# EAGLE design mega324 Control Board (EAGLE 5.07)
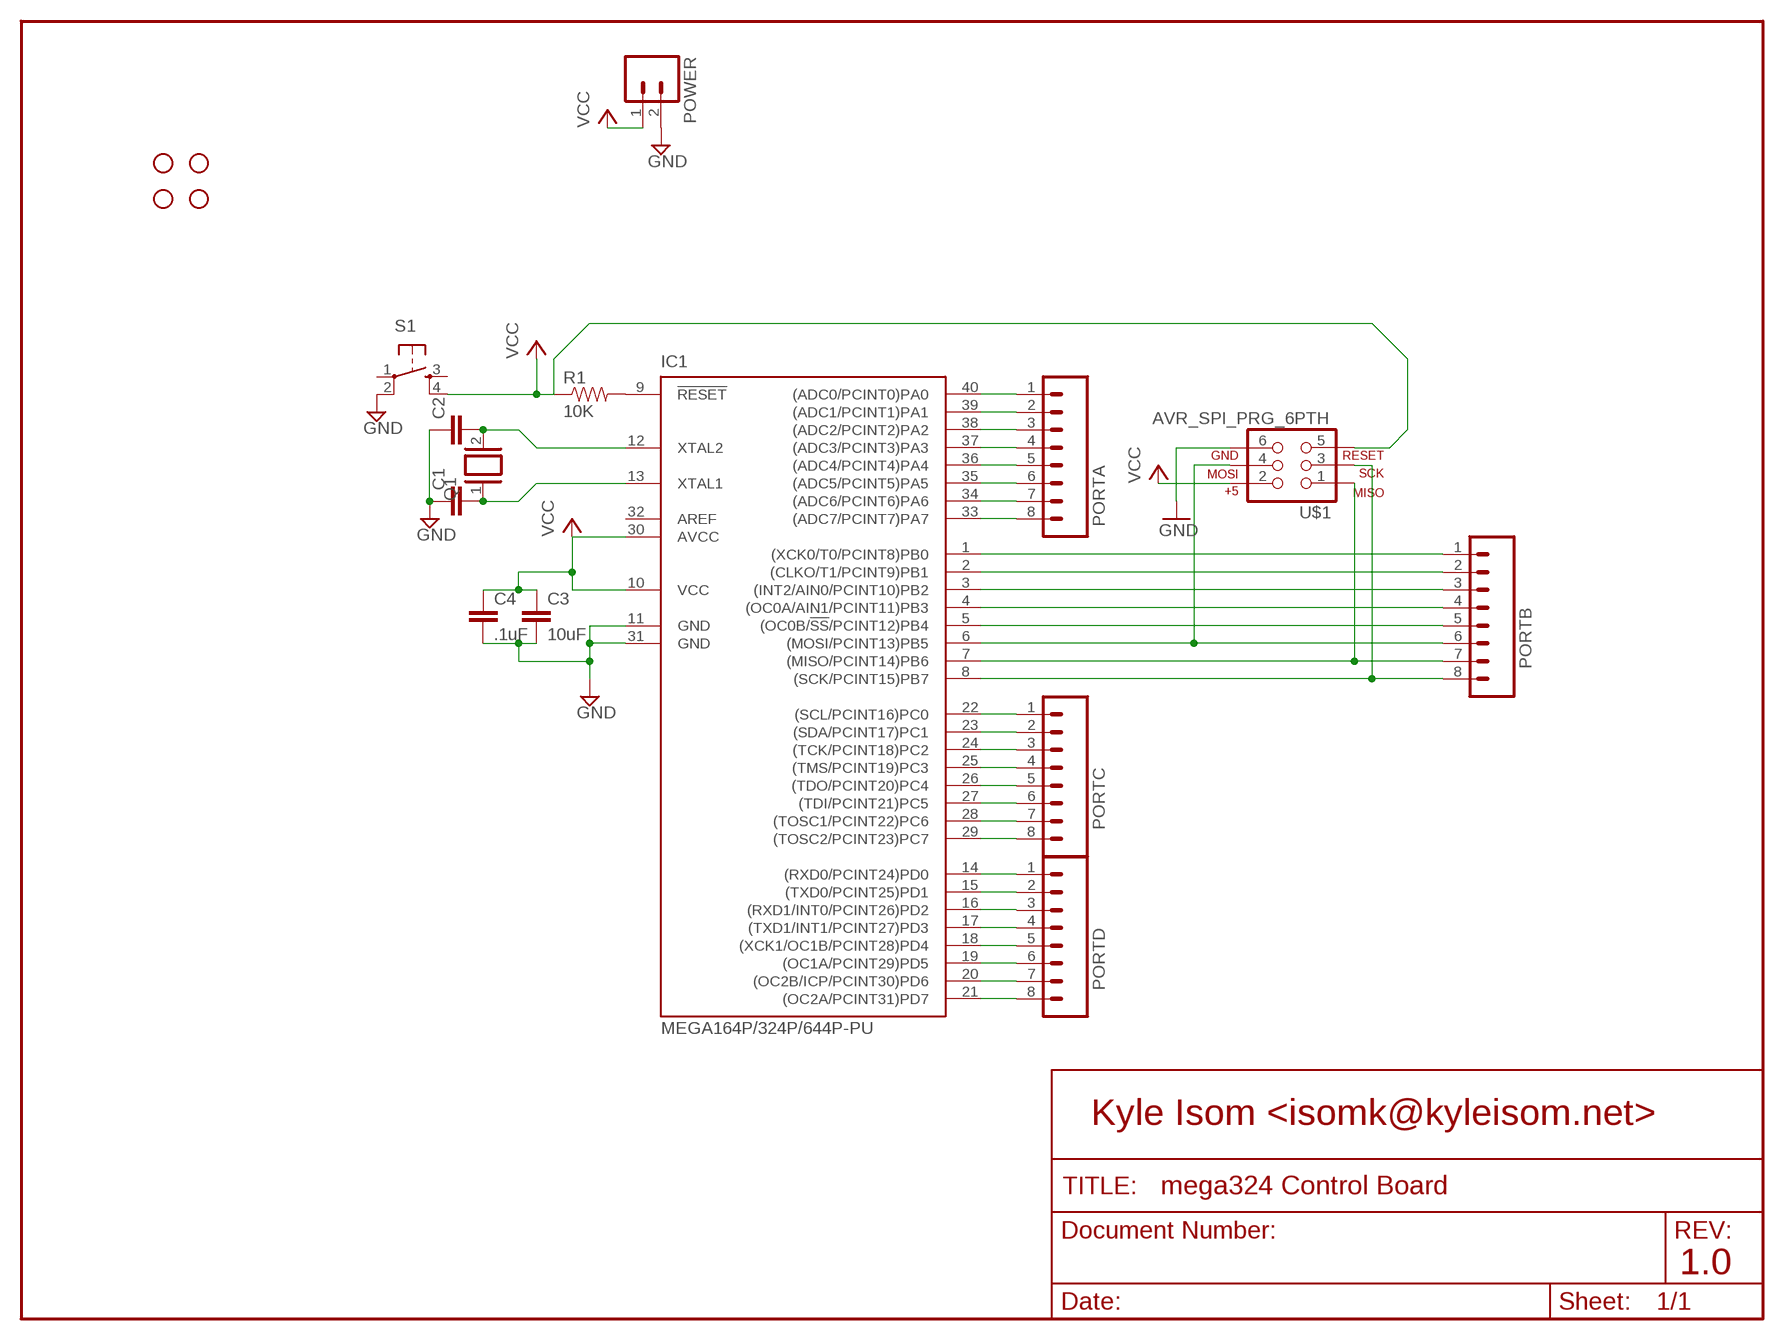
[diagram p0: schematic, sheet 1]

## Parts
C1  CAPPTH1  [CAP-PTH-5MM]
C2  CAPPTH1  [CAP-PTH-5MM]
C3  10uF  CAPPTH1  [CAP-PTH-5MM]
C4  .1uF  CAPPTH1  [CAP-PTH-5MM]
IC1  MEGA164P/324P/644P-PU  [DIL40]
JP1  STAND-OFF  [STAND-OFF]
JP2  STAND-OFF  [STAND-OFF]
JP3  STAND-OFF  [STAND-OFF]
JP4  STAND-OFF  [STAND-OFF]
PORTA  M08LOCK  [1X08_LOCK]
PORTB  M08LOCK  [1X08_LOCK]
PORTC  M08LOCK  [1X08_LOCK]
PORTD  M08LOCK  [1X08_LOCK]
POWER  M02LOCK  [1X02_LOCK]
Q1  XTAL/S  [QS]
R1  10K  RESISTORPTH1  [AXIAL-0.3]
S1  TAC_SWITCHPTH  [TACTILE-PTH]
U$1  AVR_SPI_PRG_6PTH  [2X3]

## Nets
GND: C1.1 C2.1 C3.2 C4.2 IC1.11(GND) IC1.31(GND) POWER.2 S1.2 U$1.6
N$1: IC1.9(!RESET) R1.P$2
N$2: IC1.40((ADC0/PCINT0)PA0) PORTA.1
N$3: C2.2 IC1.12(XTAL2) Q1.2
N$4: C1.2 IC1.13(XTAL1) Q1.1
N$5: IC1.39((ADC1/PCINT1)PA1) PORTA.2
N$6: IC1.38((ADC2/PCINT2)PA2) PORTA.3
N$7: IC1.37((ADC3/PCINT3)PA3) PORTA.4
N$8: IC1.36((ADC4/PCINT4)PA4) PORTA.5
N$9: IC1.35((ADC5/PCINT5)PA5) PORTA.6
N$10: IC1.34((ADC6/PCINT6)PA6) PORTA.7
N$11: IC1.33((ADC7/PCINT7)PA7) PORTA.8
N$12: IC1.1((XCK0/T0/PCINT8)PB0) PORTB.1
N$13: IC1.2((CLKO/T1/PCINT9)PB1) PORTB.2
N$14: IC1.3((INT2/AIN0/PCINT10)PB2) PORTB.3
N$15: IC1.4((OC0A/AIN1/PCINT11)PB3) PORTB.4
N$16: IC1.5((OC0B/!SS!/PCINT12)PB4) PORTB.5
N$17: IC1.6((MOSI/PCINT13)PB5) PORTB.6 U$1.4
N$18: IC1.7((MISO/PCINT14)PB6) PORTB.7 U$1.1
N$19: IC1.8((SCK/PCINT15)PB7) PORTB.8 U$1.3
N$20: IC1.22((SCL/PCINT16)PC0) PORTC.1
N$21: IC1.23((SDA/PCINT17)PC1) PORTC.2
N$22: IC1.24((TCK/PCINT18)PC2) PORTC.3
N$23: IC1.25((TMS/PCINT19)PC3) PORTC.4
N$24: IC1.26((TDO/PCINT20)PC4) PORTC.5
N$25: IC1.27((TDI/PCINT21)PC5) PORTC.6
N$26: IC1.28((TOSC1/PCINT22)PC6) PORTC.7
N$27: IC1.29((TOSC2/PCINT23)PC7) PORTC.8
N$28: IC1.14((RXD0/PCINT24)PD0) PORTD.1
N$29: IC1.15((TXD0/PCINT25)PD1) PORTD.2
N$30: IC1.16((RXD1/INT0/PCINT26)PD2) PORTD.3
N$31: IC1.17((TXD1/INT1/PCINT27)PD3) PORTD.4
N$32: IC1.18((XCK1/OC1B/PCINT28)PD4) PORTD.5
N$33: IC1.19((OC1A/PCINT29)PD5) PORTD.6
N$34: IC1.20((OC2B/ICP/PCINT30)PD6) PORTD.7
N$35: IC1.21((OC2A/PCINT31)PD7) PORTD.8
VCC: C3.1 C4.1 IC1.10(VCC) IC1.30(AVCC) POWER.1 R1.P$1 S1.4 U$1.2 U$1.5
Unconnected: S1.1 S1.3

## Notes on the sheet
- Kyle Isom <isomk@kyleisom.net>
- 1.0

## Power pins joined to a net without a drawn wire
AREF: IC1.32(AREF)

## Library data of the parts
C1-C4 = SparkFun:CAP: Capacitor Standard 0603 ceramic capacitor, and 0.1" leaded capacitor.
IC1 = avr-6:MEGA164P/324P/644P-PU
JP1-JP4 = SparkFun:STAND-OFF: Stand Off This is the mechanical footprint for a #4 phillips button head screw. Use the keepout ring to avoid running the screw head into surrounding components. SKU : PRT-00447
PORTA PORTB PORTC PORTD = SparkFun:M08: Header 8 Standard 8-pin 0.1" header. Use with straight break away headers (SKU : PRT-00116), right angle break away headers (PRT-00553), swiss pins (PRT-00743), machine pins (PRT-00117), and female headers (PRT-00115).
POWER = SparkFun:M02: Header 2 Standard 2-pin 0.1" header. Use with straight break away headers (SKU : PRT-00116), right angle break away headers (PRT-00553), swiss pins (PRT-00743), machine pins (PRT-00117), and female headers (PRT-00115). Molex polarized connector foot print use with SKU : PRT-08233 with associated crimp pins and housings.
Q1 = special:XTAL/S: CRYSTAL
R1 = SparkFun:RESISTOR: Resistor Basic schematic elements and footprints for 0603, 1206, and PTH 1/10th watt (small) resistors.
S1 = SparkFun:TAC_SWITCH: Momentary Switch Button commonly used for reset or general input. Spark Fun Electronics SKU : COM-00097
U$1 = SparkFun:AVR_SPI_PRG_6: AVR ISP 6 Pin This is the reduced ISP connector for AVR programming. Common on Arduino. This footprint will take up less PCB space and can be used with a 10-pin to 6-pin adapter such as SKU: BOB-08508

## Board
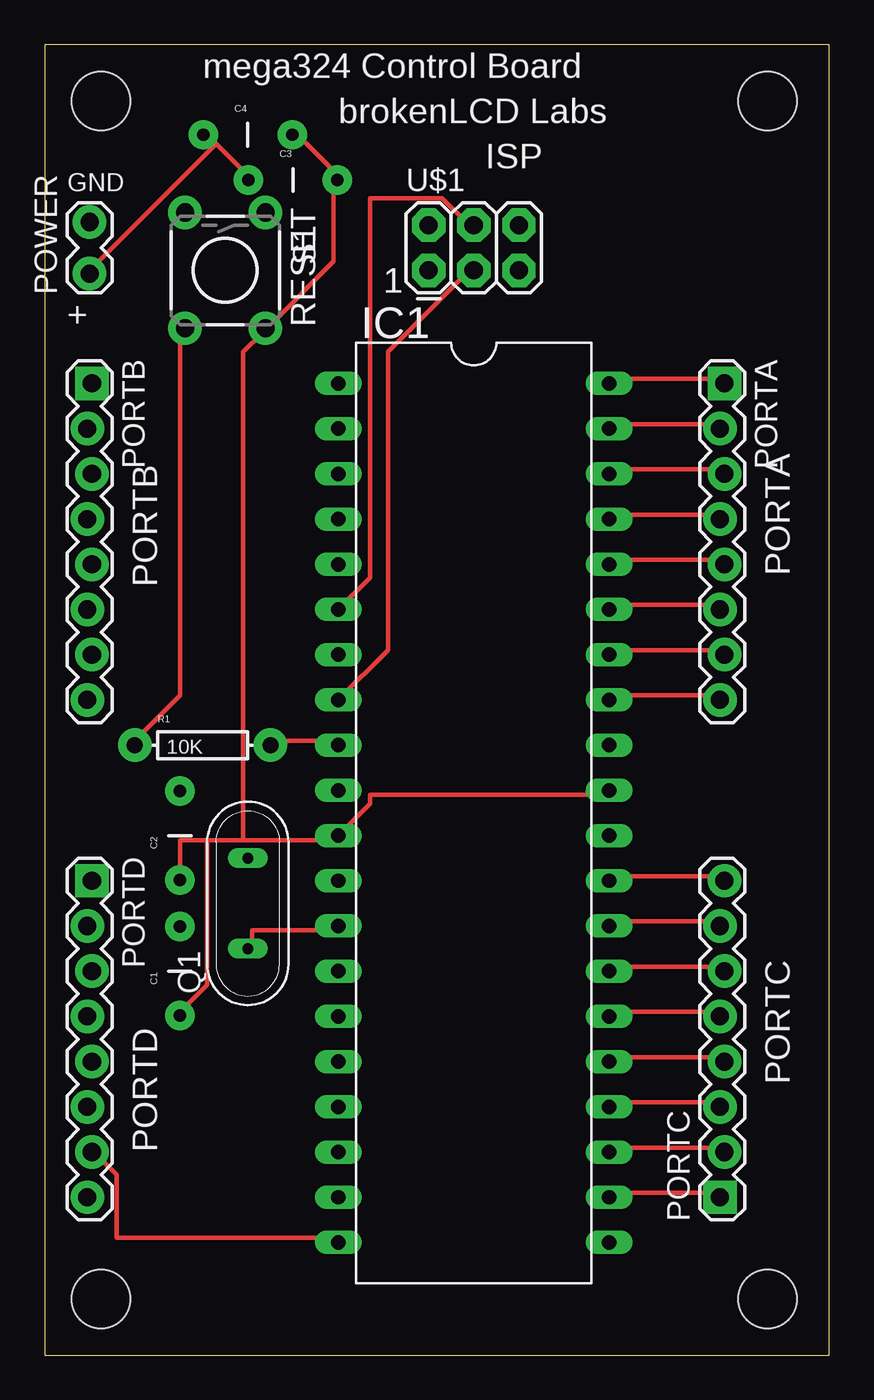
[diagram p1: board, top side]
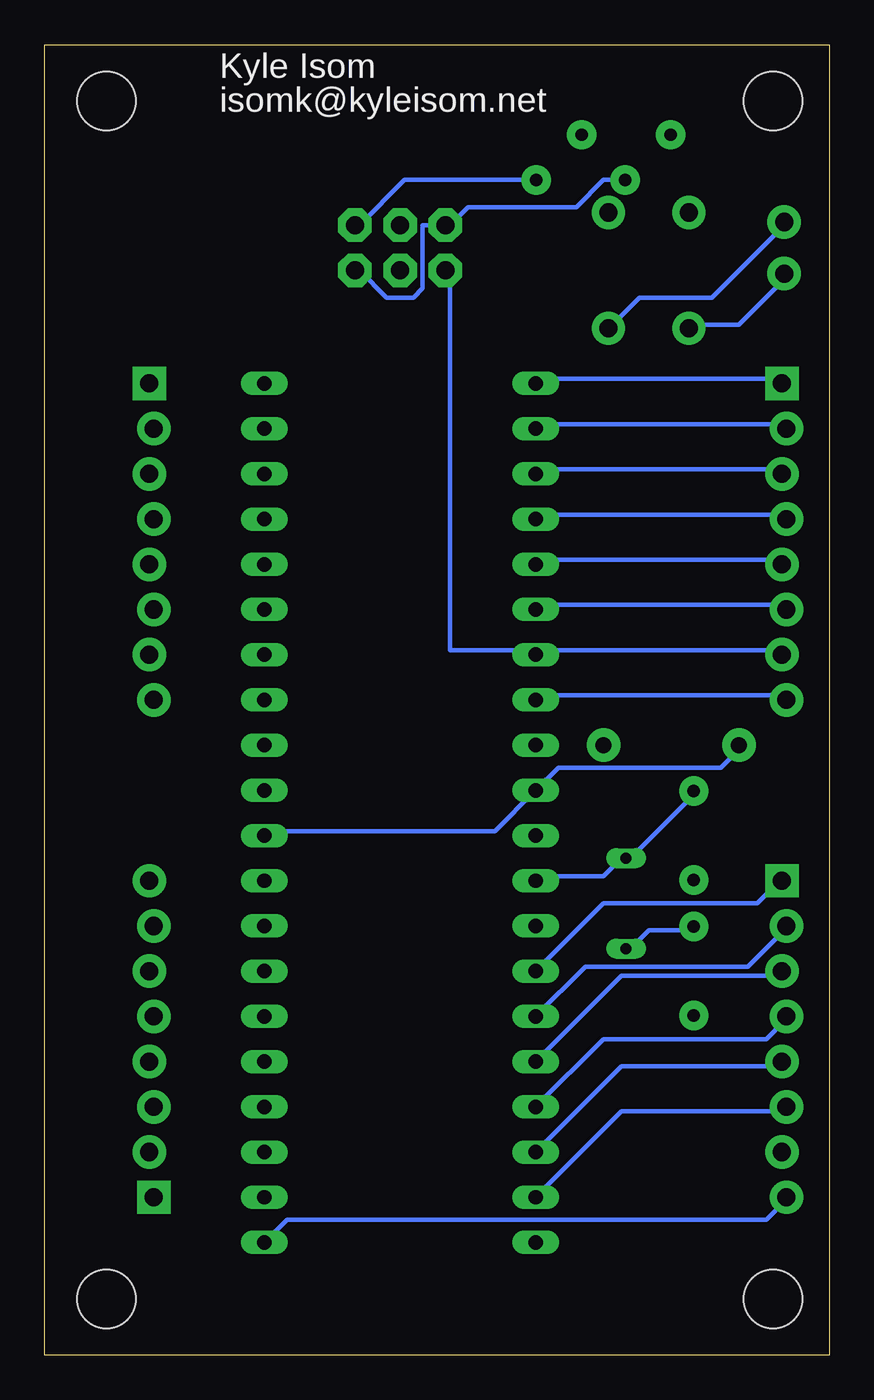
[diagram p2: board, bottom side, seen from below]

Size 44.12 x 73.65 mm. Coordinates in mm from the lower left corner, seen from the top.
Outline: 0,0 44.12,0 44.12,73.65 0,73.65 0,0
Copper layers (1*16): Top 0.035mm / dielectric 1.5mm / Bottom 0.035mm
Design rules "default": minimum track width 10mil, minimum drill 24mil, track to track 8mil, track to pad 8mil, pad to pad 8mil, via to via 8mil, smd to smd 8mil, copper to edge 40mil, drill to drill 8mil, minimum pad ring 10mil, minimum via ring 8mil, stop-mask expansion 4mil, vias tented up to drill 0mil, thermal gap 10mil

### Footprints (pad centres in the part's own frame; a part is rotated, then mirrored left to right if it is on the bottom)
CAP-PTH-5MM = drill 0.7 pad 1.651 round: 1 -2.5,0; 2 2.5,0
DIL40 = drill 0.813 long: 1 -24.13,-7.62; 2 -21.59,-7.62; 3 -19.05,-7.62; 4 -16.51,-7.62; 5 -13.97,-7.62; 6 -11.43,-7.62; 7 -8.89,-7.62; 8 -6.35,-7.62; 9 -3.81,-7.62; 10 -1.27,-7.62; 11 1.27,-7.62; 12 3.81,-7.62; 13 6.35,-7.62; 14 8.89,-7.62; 15 11.43,-7.62; 16 13.97,-7.62; 17 16.51,-7.62; 18 19.05,-7.62; 19 21.59,-7.62; 20 24.13,-7.62; 21 24.13,7.62; 22 21.59,7.62; 23 19.05,7.62; 24 16.51,7.62; 25 13.97,7.62; 26 11.43,7.62; 27 8.89,7.62; 28 6.35,7.62; 29 3.81,7.62; 30 1.27,7.62; 31 -1.27,7.62; 32 -3.81,7.62; 33 -6.35,7.62; 34 -8.89,7.62; 35 -11.43,7.62; 36 -13.97,7.62; 37 -16.51,7.62; 38 -19.05,7.62; 39 -21.59,7.62; 40 -24.13,7.62
STAND-OFF = hole 3.302: 0,0
1X08_LOCK = drill 1.016 pad 1.88 square: 1 0,0.127 | drill 1.016 pad 1.88 round: 2 2.54,-0.127; 3 5.08,0.127; 4 7.62,-0.127; 5 10.16,0.127; 6 12.7,-0.127; 7 15.24,0.127; 8 17.78,-0.127
1X02_LOCK = drill 1.016 pad 1.88 round: 1 -0.178,0; 2 2.718,0
QS = drill 0.61 long: 1 -2.54,0; 2 2.54,0
AXIAL-0.3 = drill 0.9 pad 1.88 round: P$1 -3.81,0; P$2 3.81,0
TACTILE-PTH = drill 1.016 pad 1.88 round: 1 -3.251,2.261; 2 3.251,2.261; 3 -3.251,-2.261; 4 3.251,-2.261
2X3 = drill 1.016 pad 1.88 octagon: 1 0,0; 2 0,2.54; 3 2.54,0; 4 2.54,2.54; 5 5.08,0; 6 5.08,2.54

### Placement (x,y rotation side)
C1  7.62,21.59 90 top
C2  7.62,29.21 90 top
C3  13.97,66.04 0 top
C4  11.43,68.58 0 top
IC1  24.13,30.48 270 top
JP1  3.17,3.17 0 top
JP2  40.64,3.17 0 top
JP3  40.64,70.48 0 top
JP4  3.17,70.48 0 top
PORTA  38.1,54.61 270 top
PORTB  2.54,54.61 270 top
PORTC  38.1,8.89 90 top
PORTD  2.54,26.67 270 top
POWER  2.54,60.96 90 top
Q1  11.43,25.4 90 top
R1  8.89,34.29 0 top
S1  10.16,60.96 270 top
U$1  21.59,60.96 0 top

### Tracks (layer width: path | path; a pad name or v marks a point on that pad's centre or on a via)
GND
  Top 0.254: 9.14,28.96 7.62,28.96 C2.1 | 9.14,28.96 11.18,28.96 | 11.18,28.96 16.26,28.96 IC1.11 18.29,30.99 18.29,31.5 31.5,31.5 IC1.31 | 9.14,28.96 9.14,20.83 7.62,19.3 C1.1 | 16.26,66.04 16.26,66.55 14.22,68.58 C4.2 | 16.26,66.04 16.26,61.47 12.7,57.91 S1.2 12.19,57.4 11.18,56.39 11.18,28.96 | 16.26,66.04 C3.2
  Bottom 0.254: U$1.6 26.42,63.5 23.88,66.04 C3.2 | POWER.2 2.54,63.5 6.6,59.44 10.67,59.44 12.19,57.91 S1.2
N$1
  Top 0.254: IC1.9 16.26,34.54 12.7,34.54 R1.P$2
N$2
  Top 0.254: IC1.40 32,54.86 38.1,54.86 PORTA.1
N$3
  Bottom 0.254: IC1.12 16.26,26.92 12.7,26.92 11.68,27.94 Q1.2 11.18,27.94 7.62,31.5 C2.2
N$4
  Top 0.254: IC1.13 16.26,23.88 11.68,23.88 11.68,22.86 Q1.1
  Bottom 0.254: Q1.1 11.18,22.86 10.16,23.88 7.62,23.88 C1.2
N$5
  Top 0.254: IC1.39 32,52.32 37.59,52.32 PORTA.2
N$6
  Top 0.254: IC1.38 32,49.78 38.1,49.78 PORTA.3
N$7
  Top 0.254: IC1.37 32,47.24 37.59,47.24 PORTA.4
N$8
  Top 0.254: IC1.36 32,44.7 38.1,44.7 PORTA.5
N$9
  Top 0.254: IC1.35 32,42.16 37.59,42.16 PORTA.6
N$10
  Top 0.254: IC1.34 32,39.62 38.1,39.62 PORTA.7
N$11
  Top 0.254: IC1.33 32,37.08 37.59,37.08 PORTA.8
N$12
  Bottom 0.254: IC1.1 16.26,54.86 3.05,54.86 PORTB.1
N$13
  Bottom 0.254: IC1.2 16.26,52.32 2.54,52.32 PORTB.2
N$14
  Bottom 0.254: IC1.3 16.26,49.78 3.05,49.78 PORTB.3
N$15
  Bottom 0.254: IC1.4 16.26,47.24 2.54,47.24 PORTB.4
N$16
  Bottom 0.254: IC1.5 16.26,44.7 3.05,44.7 PORTB.5
N$17
  Top 0.254: U$1.4 23.88,63.5 22.35,65.02 18.29,65.02 18.29,43.69 IC1.6
  Bottom 0.254: IC1.6 16.26,42.16 2.54,42.16 PORTB.6
N$18
  Bottom 0.254: PORTB.7 3.05,39.62 16.26,39.62 IC1.7 16.76,39.62 21.34,39.62 21.34,60.96 U$1.1
N$19
  Top 0.254: U$1.3 23.88,60.96 19.3,56.39 19.3,39.62 IC1.8
  Bottom 0.254: IC1.8 16.26,37.08 2.54,37.08 PORTB.8
N$20
  Top 0.254: IC1.22 32,9.14 37.59,9.14 PORTC.1
N$21
  Top 0.254: IC1.23 32,11.68 38.1,11.68 PORTC.2
N$22
  Top 0.254: IC1.24 32,14.22 37.59,14.22 PORTC.3
N$23
  Top 0.254: IC1.25 32,16.76 38.1,16.76 PORTC.4
N$24
  Top 0.254: IC1.26 32,19.3 37.59,19.3 PORTC.5
N$25
  Top 0.254: IC1.27 32,21.84 38.1,21.84 PORTC.6
N$26
  Top 0.254: IC1.28 32,24.38 37.59,24.38 PORTC.7
N$27
  Top 0.254: IC1.29 32,26.92 38.1,26.92 PORTC.8
N$28
  Bottom 0.254: IC1.14 12.7,25.4 4.06,25.4 3.05,26.42 PORTD.1
N$29
  Bottom 0.254: IC1.15 13.72,21.84 4.57,21.84 2.54,23.88 PORTD.2
N$30
  Bottom 0.254: IC1.16 11.68,21.34 3.05,21.34 PORTD.3
N$31
  Bottom 0.254: IC1.17 12.7,17.78 3.56,17.78 2.54,18.8 PORTD.4
N$32
  Bottom 0.254: IC1.18 11.68,16.26 3.05,16.26 PORTD.5
N$33
  Bottom 0.254: IC1.19 11.68,13.72 2.54,13.72 PORTD.6
N$34
  Top 0.254: IC1.20 16.26,6.6 4.06,6.6 4.06,10.16 3.05,11.18 PORTD.7
N$35
  Bottom 0.254: IC1.21 30.48,7.62 3.56,7.62 2.54,8.64 PORTD.8
VCC
  Top 0.254: 9.65,68.07 11.18,66.55 11.18,66.04 C3.1 | 9.65,68.07 9.14,68.58 C4.1 | 9.65,68.07 2.54,60.96 POWER.1 | R1.P$1 5.08,34.54 7.62,37.08 7.62,57.4 S1.4
  Bottom 0.254: IC1.30 31.5,29.46 18.8,29.46 IC1.10 15.24,33.02 6.1,33.02 5.08,34.04 R1.P$1 | U$1.5 26.42,60.96 24.89,59.44 23.37,59.44 22.86,59.94 22.86,63.5 U$1.2 21.34,63.5 20.32,64.52 14.22,64.52 12.7,66.04 C3.1 | POWER.1 2.54,60.45 5.08,57.91 7.62,57.91 S1.4

### Text on the board
tPlace: mega324 Control Board | brokenLCD Labs | ISP | GND | 1 | + | RESET | PORTA | PORTB | PORTC | PORTD
bPlace: Kyle Isom | isomk@kyleisom.net